# Altium schematic sheet RPI 3.SchDoc
size A4; SheetNumber: 1; SheetTotal: 1
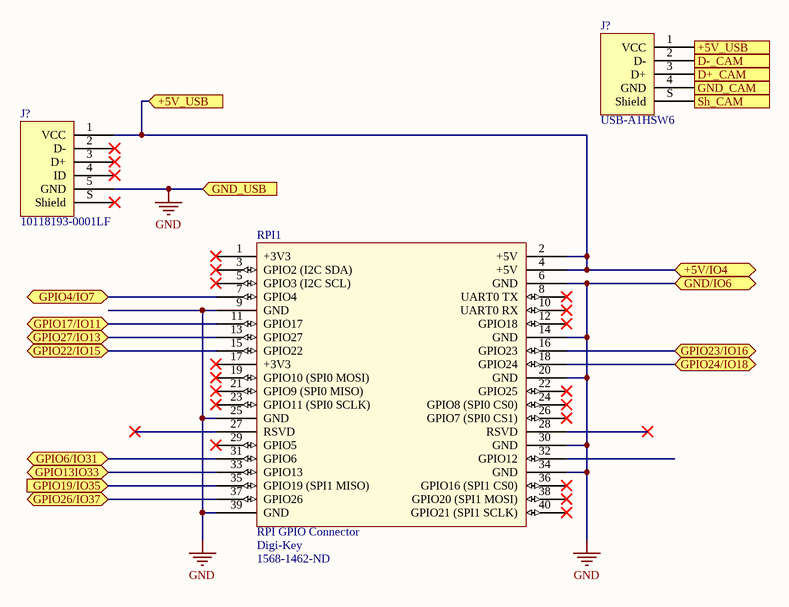
[diagram p0: RPI 3.SchDoc]

## Parts
(Parts that share a designator on the sheet are numbered #1, #2 ... from top to bottom, then left to right.)
J?#1  USB-A1HSW6  [ON SHORE TECHNOLOGY USB-A1HSW6]
J?#2  10118193-0001LF  [FCI USB 10118193-0001LF]
RPI1  RPI GPIO Connector  Supplier 1: Digi-Key  Supplier Part Number 1: 1568-1462-ND  [rpi]

## Ports
+5V/IO4 (bidir), +5V_USB (in), D+_CAM (in), D-_CAM (in), GND/IO6 (bidir), GND_CAM (in), GND_USB (in), GPIO4/IO7 (bidir), GPIO6/IO31 (bidir), GPIO13IO33 (bidir), GPIO17/IO11 (bidir), GPIO19/IO35 (in), GPIO22/IO15 (bidir), GPIO23/IO16 (bidir), GPIO24/IO18 (bidir), GPIO26/IO37 (bidir), GPIO27/IO13 (bidir), Sh_CAM (in)

## Nets
GND: J?#2.5(GND) RPI1.6(GND) RPI1.9(GND) RPI1.14(GND) RPI1.20(GND) RPI1.25(GND) RPI1.30(GND) RPI1.34(GND) RPI1.39(GND) ; port GND/IO6, port GND_USB
+5V/IO4: J?#1.1(VCC) J?#2.1(VCC) RPI1.2(+5V) RPI1.4(+5V) ; port +5V/IO4, port +5V_USB
D+_CAM: J?#1.3(D+) ; port D+_CAM
D-_CAM: J?#1.2(D-) ; port D-_CAM
GND_CAM: J?#1.4(GND) ; port GND_CAM
GPIO4/IO7: RPI1.7(GPIO4) ; port GPIO4/IO7
GPIO6/IO31: RPI1.31(GPIO6) ; port GPIO6/IO31
GPIO13IO33: RPI1.33(GPIO13) ; port GPIO13IO33
GPIO17/IO11: RPI1.11(GPIO17) ; port GPIO17/IO11
GPIO19/IO35: RPI1.35(GPIO19_(SPI1_MISO)) ; port GPIO19/IO35
GPIO22/IO15: RPI1.15(GPIO22) ; port GPIO22/IO15
GPIO23/IO16: RPI1.16(GPIO23) ; port GPIO23/IO16
GPIO24/IO18: RPI1.18(GPIO24) ; port GPIO24/IO18
GPIO26/IO37: RPI1.37(GPIO26) ; port GPIO26/IO37
GPIO27/IO13: RPI1.13(GPIO27) ; port GPIO27/IO13
Sh_CAM: J?#1.S(Shield) ; port Sh_CAM

Not connected (* = marked no-connect by the designer): J?#2 2(D-)* 3(D+)* 4(ID)* S(Shield)*; RPI1 1(+3V3)* 3(GPIO2_(I2C_SDA))* 5(GPIO3_(I2C_SCL))* 8(UART0_TX)* 10(UART0_RX)* 12(GPIO18)* 17(+3V3)* 19(GPIO10_(SPI0_MOSI))* 21(GPIO9_(SPI0_MISO))* 22(GPIO25)* 23(GPIO11_(SPI0_SCLK))* 24(GPIO8_(SPI0_CS0))* 26(GPIO7_(SPI0_CS1))* 27(RSVD)* 28(RSVD)* 29(GPIO5)* 32(GPIO12) 36(GPIO16_(SPI1_CS0))* 38(GPIO20_(SPI1_MOSI))* 40(GPIO21_(SPI1_SCLK))*

## Library data of the parts
J?#1 = USB-A1HSW6: CONN RCPT TYPEA 4POS R/A; Manufacturer: On Shore Technology Inc.; Connector Type: USB - A; Current Rating (Amps): 1A; Gender: Receptacle; Number of Contacts: 4; Number of Ports: 1; Shielding: Unshielded; Voltage - Rated: 30VAC; Part Number: USB-A1HSW6; ComponentLink1Description: Datasheet; ComponentLink1URL: http://www.on-shore.com/wp-content/uploads/USB-A1HSXX.pdf; ComponentLink2Description: DigiKey Link; ComponentLink2URL: http://digikey.com/product-detail/en/on-shore-technology-inc/USB-A1HSW6/ED2989-ND/2677750; Features: Board Lock; LastUpdated: 30.04.2020 11:56:44; Lifecycle Status: Active; Minimum Order: 1; Mounting Feature: Horizontal; Mounting Type: Through Hole, Right Angle; Operating Temperature: 0°C ~ 85°C; Packaging: Tray; Part Status: Active; Price: 0.48; Series: -; Supplier 1: DigiKey; Supplier Part Number 1: ED2989-ND; Termination: Solder
J?#2 = 10118193-0001LF: CONN RCPT USB2.0 MICRO B SMD R/A; Manufacturer: Amphenol ICC (FCI); Connector Type: USB - micro B; Current Rating (Amps): 1.8A per Contact; Gender: Receptacle; Mating Cycles: 10000; Number of Contacts: 5; Number of Ports: 1; Shielding: Shielded; Voltage - Rated: 100VAC; Part Number: 10118193-0001LF; ComponentLink1Description: Datasheet; ComponentLink1URL: https://cdn.amphenol-icc.com/media/wysiwyg/files/documentation/datasheet/inputoutput/io_usb_micro.pdf; ComponentLink2Description: DigiKey Link; ComponentLink2URL: //digikey.com/product-detail/en/amphenol-icc-fci/10118193-0001LF/609-4616-2-ND/2785388; Features: Solder Retention; LastUpdated: 09.12.2019 20:51:28; Lifecycle Status: 0; Minimum Order: 1; Mounting Feature: Horizontal; Mounting Type: Surface Mount, Right Angle; Through Hole; Operating Temperature: -30°C ~ 80°C; Packaging: TapeAndReel; Part Status: Active; Price: 0.21; Series: -; Specifications: USB 2.0; Supplier 1: DigiKey; Supplier Part Number 1: 609-4616-2-ND; Termination: Solder
RPI1 = rpi connector: GPIO Header for Raspberry Pi A+/B+/Pi 2/Pi 3 - 2x20; Manufacturer: SparkFun Electronics; Manufacturer Part Number: PRT-14017; Nils Minor: author; nilsminor@web.de: mail; RoHS: RoHS Compliant; Category: Development Boards, Kits, Programmers; Stock 1: 150; Pricing 1: 1=1.84 (EUR); Part Status: Active; Accessory Type: Connector; For Use With/Related Products: Raspberry Pi; ComponentLink1URL: https://cdn.sparkfun.com/datasheets/Dev/RaspberryPi/12313.pdf; ComponentLink1Description: https://cdn.sparkfun.com/datasheets/Dev/RaspberryPi/12313.pdf